# Altium project EPaper.PrjPcb
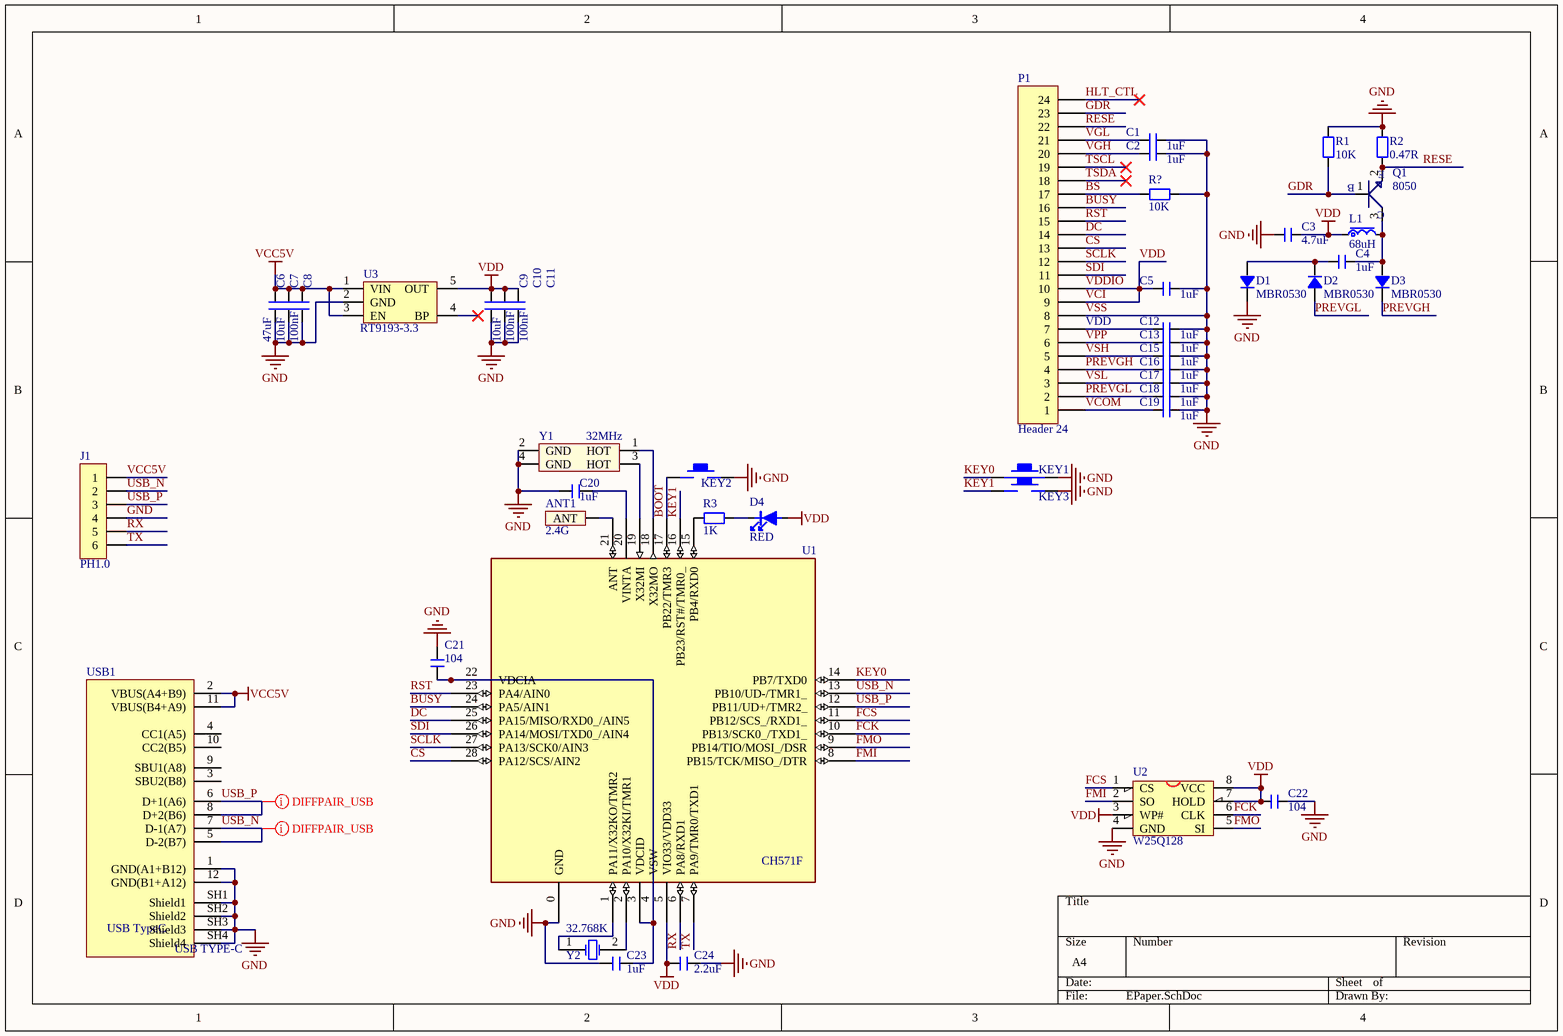
[diagram p0: EPaper.SchDoc]
1 sheet, 45 parts. Net scope: global (net labels, ports and power ports of the same name join across sheets).
Board file: EPaper.PcbDoc

## Sheet EPaper.SchDoc
size A4

### Parts
ANT1  2.4G  [2.4GANTS8]
C1  1uF  [C 0603_L]
C2  1uF  [C 0603_L]
C3  4.7uF  [C 0603_L]
C4  1uF  [C 0603_L]
C5  1uF  [C 0603_L]
C6  47uF  [C 0603_L]
C7  10uF  [C 0603_L]
C8  100nF  [C 0603_L]
C9  10uF  [C 0603_L]
C10  100nF  [C 0603_L]
C11  100nF  [C 0603_L]
C12  1uF  [C 0603_L]
C13  1uF  [C 0603_L]
C15  1uF  [C 0603_L]
C16  1uF  [C 0603_L]
C17  1uF  [C 0603_L]
C18  1uF  [C 0603_L]
C19  1uF  [C 0603_L]
C20  1uF  [C 0603_L]
C21  104  [C 0603_L]
C22  104  [C 0603_L]
C23  1uF  [C 0603_L]
C24  2.2uF  [C 0603_L]
D1  MBR0530  [SOD-323]
D2  MBR0530  [SOD-323]
D3  MBR0530  [SOD-323]
D4  RED  [LED 0603B]
J1  PH1.0  [SH1.0 S-W-6P]
KEY1  KEY-SMD  [TSW SMD-3*6*2.5]  (value not drawn)
KEY2  KEY-SMD  [TSW SMD-3*6*2.5]  (value not drawn)
KEY3  KEY-SMD  [TSW SMD-3*6*2.5]  (value not drawn)
L1  68uH  [NR3015]
P1  Header 24  [FPC0.5 2H-WS-24P]
Q1  8050  [SOT23-3L]
R1  10K  [R 0603_L]
R2  0.47R  [R 0603_L]
R3  1K  [R 0603_L]
R?  10K  [R 0603_L]
U1  CH571F  [QFN28_4X4]
U2  W25Q128  [SOP8W_L]
U3  RT9193-3.3  [SOT23-5L]
USB1  USB TypeC  [USB Type-C]
Y1  32MHz  [OSC 3225-4P]
Y2  32.768K  [OSC 3215-2P]

### Nets
GND: C1.2 C2.2 C3.1 C5.2 C6.2 C7.2 C8.2 C9.2 C10.2 C11.2 C12.2 C13.2 C15.2 C16.2 C17.2 C18.2 C19.2 C20.2 C21.2 C22.2 C23.2 C24.2 D1.2 J1.4 KEY1.1 KEY2.1 KEY3.1 P1.8 R1.2 R2.2 R?.1 U1.0(GND) U2.4(GND) U3.2(GND) USB1.1(GND(A1+B12)) USB1.12(GND(B1+A12)) USB1.SH1(Shield1) USB1.SH2(Shield2) USB1.SH3(Shield3) USB1.SH4(Shield4) Y1.2(GND) Y1.4(GND)  [also labelled VSS]
VCC5V: C6.1 C7.1 C8.1 J1.1 U3.1(VIN) U3.3(EN) USB1.2(VBUS(A4+B9)) USB1.11(VBUS(B4+A9))
VCI: C3.2 C5.1 C9.1 C10.1 C11.1 C22.1 C24.1 D4.1 L1.1 P1.9 P1.10 U1.5(VIO33/VDD33) U2.3(WP#) U2.7(HOLD) U2.8(VCC) U3.5(OUT)  [also labelled VDD, VDDIO]
BOOT: KEY2.2 U1.17(PB22/TMR3)
BS: P1.17 R?.2
BUSY: P1.16 U1.24(PA5/AIN1)
CS: P1.13 U1.28(PA12/SCS/AIN2)
DC: P1.14 U1.25(PA15/MISO/RXD0_/AIN5)
FCK: U1.10(PB13/SCK0_/TXD1_) U2.6(CLK)
FCS: U1.11(PB12/SCS_/RXD1_) U2.1(CS)
FMI: U1.8(PB15/TCK/MISO_/DTR) U2.2(SO)
FMO: U1.9(PB14/TIO/MOSI_/DSR) U2.5(SI)
GDR: P1.23 Q1.1(B) R1.1
HLT_CTL: P1.24
KEY0: KEY1.2 U1.14(PB7/TXD0)
KEY1: KEY3.2 U1.16(PB23/RST#/TMR0_)
PREVGH: C16.1 D3.2 P1.4
PREVGL: C18.1 D2.1 P1.2
RESE: P1.22 Q1.2(E) R2.1
RST: P1.15 U1.23(PA4/AIN0)
RX: J1.5 U1.6(PA8/RXD1)
SCLK: P1.12 U1.27(PA13/SCK0/AIN3)
SDI: P1.11 U1.26(PA14/MOSI/TXD0_/AIN4)
TSCL: P1.19
TSDA: P1.18
TX: J1.6 U1.7(PA9/TMR0/TXD1)
USB_N: J1.2 U1.13(PB10/UD-/TMR1_) USB1.5(D-2(B7)) USB1.7(D-1(A7))
USB_P: J1.3 U1.12(PB11/UD+/TMR2_) USB1.6(D+1(A6)) USB1.8(D+2(B6))
VCOM: C19.1 P1.1
VGH: C2.1 P1.20
VGL: C1.1 P1.21
VPP: C13.1 P1.6
VSH: C15.1 P1.5
VSL: C17.1 P1.3
NetANT1_1: ANT1.1(ANT) U1.21(ANT)
NetC4_1: C4.1 D1.1 D2.2
NetC4_2: C4.2 D3.1 L1.2 Q1.3(C)
NetC12_1: C12.1 P1.7
NetC20_1: C20.1 U1.20(VINTA)
NetC21_1: C21.1 C23.1 U1.3(VDCID) U1.4(VSW) U1.22(VDCIA)
NetD4_2: D4.2 R3.1
NetR3_2: R3.2 U1.15(PB4/RXD0)
NetU1_1: U1.1(PA11/X32KO/TMR2) Y2.1(OSC1)
NetU1_2: U1.2(PA10/X32KI/TMR1) Y2.2(OSC2)
NetU1_18: U1.18(X32MO) Y1.1(HOT)
NetU1_19: U1.19(X32MI) Y1.3(HOT)

Not connected (* = marked no-connect by the designer): U3 4(BP)*; USB1 3(SBU2(B8)) 4(CC1(A5)) 9(SBU1(A8)) 10(CC2(B5))

### Layout directives
differential pair: USB_N, USB_P

### Notes on the sheet
- (near P1) VDD
- (in symbol USB 2.0 Type C) USB TYPE-C

### Library data of the parts
ANT1 = ANT: 2.4G天线
C1-C13 C15-C24 = C: 无极性贴片电容
  C1-C5 C12 C13 C15-C19 C22: BOM名称: 无极性贴片电容
D1-D3 = D-US1M: 开关二级管
D4 = LED: 发光二极管
J1 = Header 6: 6P接插件; 版权归属: 源创客; BOM名称: 6P接插件; 学习资源: www.ooocke.com
KEY1-KEY3 = S-KEY-SMD-324225: KEY,SMD,324225
L1 = L-CDRH: 功率屏蔽电感; BOM名称: 功率屏蔽电感
P1 = Header 24: Header, 24-Pin; LatestRevisionDate: 17-Jul-2002; LatestRevisionNote: Re-released for DXP Platform.; Publisher: Altium Limited
Q1 = 8050NPN
R1-R3 R? = R: 贴片电阻
U1 = CH571F: RISC-V MCU with BLE/USB/ADC/SPI/2*UART
U2 = W25X16: W25X16;SST25VF016;MX25L1605
U3 = LDO RT9193: LDO
USB1 = USB 2.0 Type C: 12P TypeC 母座
Y1 = Y-3225-4P: 晶振25MHz; Published: 8-Jun-2000; LatestRevisionDate: 17-Jul-2002; LatestRevisionNote: Re-released for DXP Platform.; Publisher: Altium Limited
Y2 = Y-3215-2P: 晶振32.768K